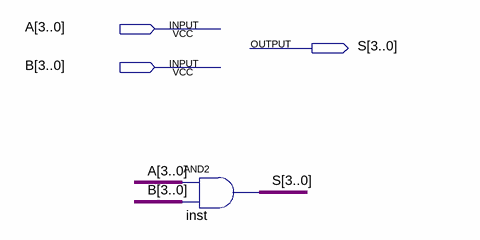
[diagram p0: schematic sheet]
// Quartus schematic OP_AND.bdf as structural Verilog: 1 symbols, 3 pins
module OP_AND (
  input  [3:0] A,
  input  [3:0] B,
  output [3:0] S
);

  assign S = A & B;  // AND2 inst, 4 bits wide
endmodule
